# EAGLE design BT840_1.27mm_headers (EAGLE 9.6.2)

## Sheet 1 of 3
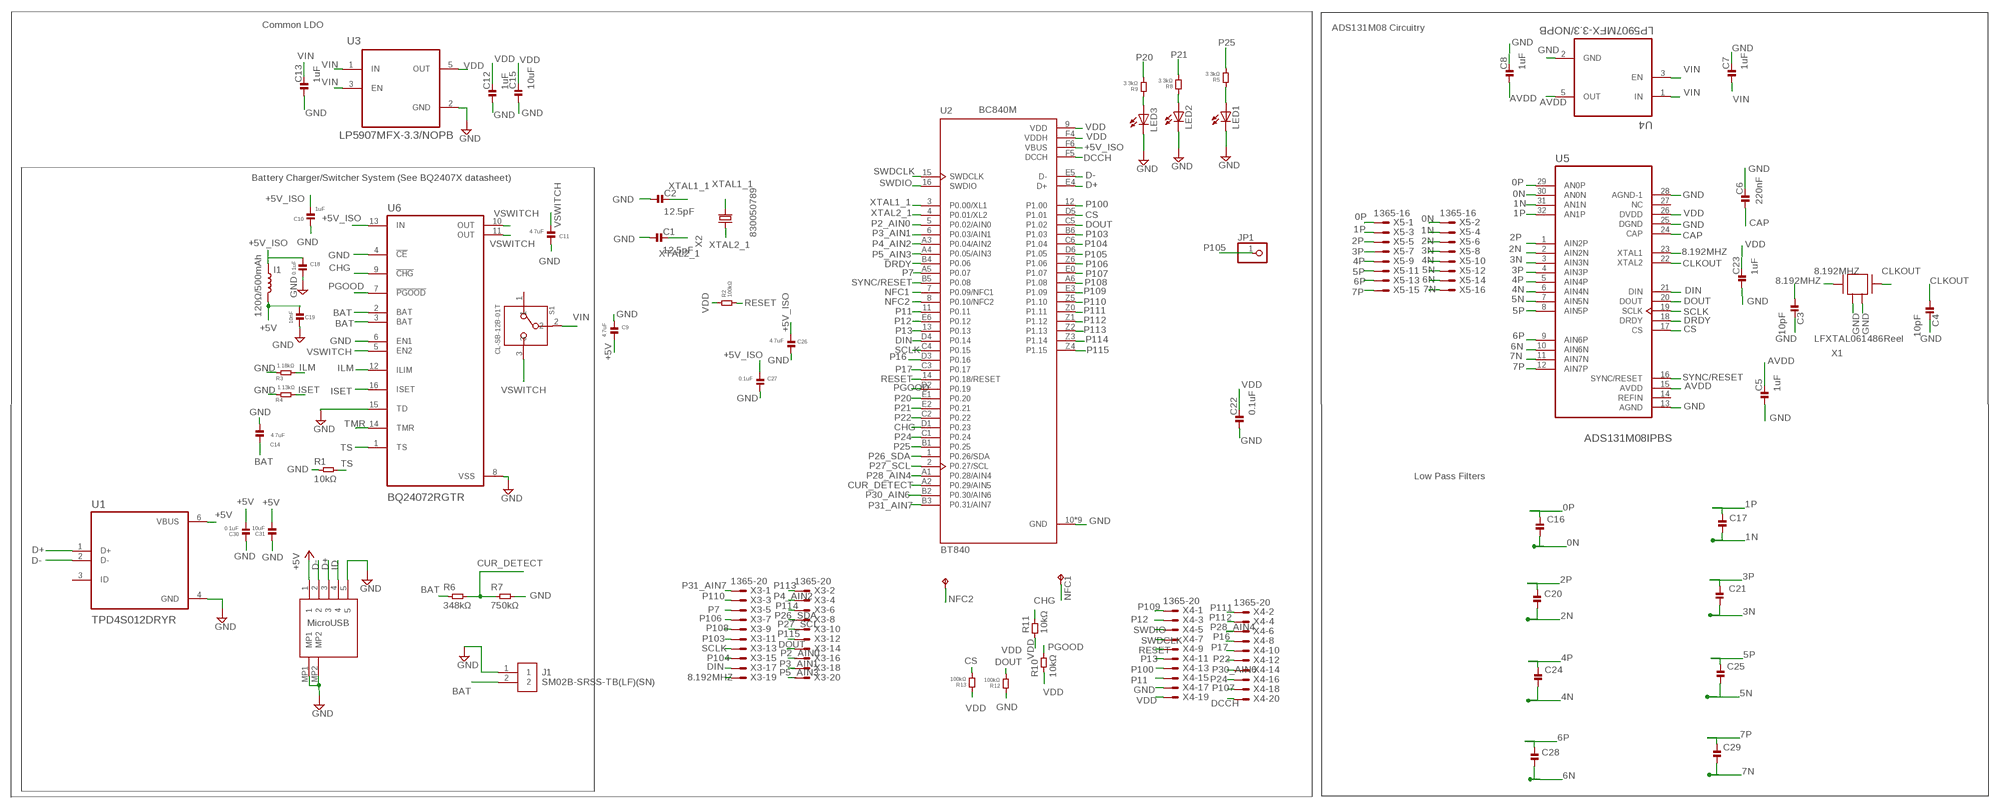
[diagram p0: schematic, sheet 1]

### Parts
C1  12.5pF  CAPACITOR.0201  [0201]
C2  12.5pF  CAPACITOR.0201  [0201]
C3  10pF  CAPACITOR.0201  [0201]
C4  10pF  CAPACITOR.0201  [0201]
C5  1uF  CAPACITOR.0201  [0201]
C6  220nF  CAPACITOR.0201  [0201]
C7  1uF  CAPACITOR.0201  [0201]
C8  1uF  CAPACITOR.0201  [0201]
C9  4.7uF  CAPACITOR.0201  [0201]
C10  1uF  CAPACITOR.0201  [0201]
C11  4.7uF  CAPACITOR.0201  [0201]
C12  1uF  CAPACITOR.0201  [0201]
C13  1uF  CAPACITOR.0201  [0201]
C14  4.7uF  CAPACITOR.0201  [0201]
C15  10uF  CAPACITOR.0402  [0402]
C16  100pF  CAPACITOR.0201  [0201]
C17  100pF  CAPACITOR.0201  [0201]
C18  0.1uF  CAPACITOR.0201  [0201]
C19  10nF  CAPACITOR.0201  [0201]
C20  100pF  CAPACITOR.0201  [0201]
C21  100pF  CAPACITOR.0201  [0201]
C22  0.1uF  CAPACITOR.0201  [0201]
C23  1uF  CAPACITOR.0201  [0201]
C24  100pF  CAPACITOR.0201  [0201]
C25  100pF  CAPACITOR.0201  [0201]
C26  4.7uF  CAPACITOR.0201  [0201]
C27  0.1uF  CAPACITOR.0201  [0201]
C28  100pF  CAPACITOR.0201  [0201]
C29  100pF  CAPACITOR.0201  [0201]
C30  0.1uF  CAPACITOR.0201  [0201]
C31  10uF  CAPACITOR.0402  [0402]
I1  120Ω/500mAh  12NH-0402  [0402_COILCRAFT]
J1  SM02B-SRSS-TB(LF)(SN)  [SM02B-SRSS-TB(LF)(SN)]
JP1  PINHD-1X1  [1X01]
LED1  LEDCHIPLED_0603  [CHIPLED_0603]
LED2  LEDCHIPLED_0603  [CHIPLED_0603]
LED3  LEDCHIPLED_0603  [CHIPLED_0603]
NFC1  TPTP14SQ  [TP14SQ]
NFC2  TPTP14SQ  [TP14SQ]
R1  10kΩ  RESISTOR.0201  [0201]
R2  100kΩ  RESISTOR.0201  [0201]
R3  1.18kΩ  RESISTOR.0201  [0201]
R4  1.13kΩ  RESISTOR.0201  [0201]
R5  3.3kΩ  RESISTOR.0201  [0201]
R6  348kΩ  RESISTOR.0201  [0201]
R7  750kΩ  RESISTOR.0201  [0201]
R8  3.3kΩ  RESISTOR.0201  [0201]
R9  3.3kΩ  RESISTOR.0201  [0201]
R10  10kΩ  RESISTOR.0402  [0402]
R11  10kΩ  RESISTOR.0402  [0402]
R12  100kΩ  RESISTOR.0402  [0402]
R13  100kΩ  RESISTOR.0402  [0402]
S1  CL-SB-12B-01T  [CL-SB-12B]
U1  TPD4S012DRYR  [PSON50P145X100X60-6N]
U2  BT840  [XCVR_BT840]
U3  LP5907MFX-3.3/NOPB  [SOT95P280X145-5N]
U4  LP5907MFX-3.3/NOPB  [SOT95P280X145-5N]
U5  ADS131M08IPBS  [QFP50P700X700X120-32N]
U6  BQ24072RGTR  [QFN50P300X300X100-17N]
U7  DX4R005JJ2R1800  [DX4R005JJ2R1800]
X1  ABM3B-8.000MHZ-B2-T  [ABM3B-8.000MHZ-B2-T]
X2  FC-12M  [FC-12M]
X3  1365-20  [1365-20]
X4  1365-20  [1365-20]
X5  1365-16  [1365-16]

### Nets
0N: C16.2 U5.30(AN0N) X5.2
0P: C16.1 U5.29(AN0P) X5.1
1N: C17.2 U5.31(AN1N) X5.4
1P: C17.1 U5.32(AN1P) X5.3
2N: C20.2 U5.2(AIN2N) X5.6
2P: C20.1 U5.1(AIN2P) X5.5
3N: C21.2 U5.3(AIN3N) X5.8
3P: C21.1 U5.4(AIN3P) X5.7
4N: C24.2 U5.6(AIN4N) X5.10
4P: C24.1 U5.5(AIN4P) X5.9
5N: C25.2 U5.7(AIN5N) X5.12
5P: C25.1 U5.8(AIN5P) X5.11
6N: C28.2 U5.10(AIN6N) X5.14
6P: C28.1 U5.9(AIN6P) X5.13
7N: C29.2 U5.11(AIN7N) X5.16
7P: C29.1 U5.12(AIN7P) X5.15
8.192MHZ: C3.1 U5.23(XTAL1) X1.1 X3.19
+5V: C9.2 C19.2 C30.2 C31.2 I1.P$2 U1.6(VBUS) U7.1
+5V_ISO: C10.2 C18.1 C26.2 C27.2 I1.P$1 U2.F6(VBUS) U6.13(IN)
AVDD: C5.2 C8.1 U4.5(OUT) U5.15(AVDD)
BAT: C14.2 J1.2 R6.1 U6.2(BAT) U6.3(BAT)
CAP: C6.1 U5.24(CAP)
CHG: R11.2 U2.D1(P0.23) U6.9(!CHG)
CLKOUT: C4.1 U5.22(XTAL2) X1.3
CS: R13.1 U2.D5(P1.01) U5.17(CS)
CUR_DETECT: R6.2 R7.1 U2.A2(P0.29/AIN5)
D+: U1.1(D+) U2.E4(D+) U7.3
D-: U1.2(D-) U2.E5(D-) U7.2
DCCH: U2.F5(DCCH) X4.20
DIN: U2.D4(P0.14) U5.21(DIN) X3.17
DOUT: R12.1 U2.C5(P1.02) U5.20(DOUT) X3.14
DRDY: U2.B4(P0.06) U5.18(DRDY)
GND: C1.1 C2.1 C3.2 C4.2 C5.1 C6.2 C7.2 C8.2 C9.1 C10.1 C11.1 C12.1 C13.1 C14.1 C15.1 C18.2 C19.1 C22.1 C23.1 C26.1 C27.1 C30.1 C31.1 J1.1 LED1.C LED2.C LED3.C R1.1 R3.1 R4.1 R7.2 R12.2 U1.4(GND) U2.10(GND) U2.A0(GND) U2.B0(GND) U2.C0(GND) U2.D0(GND) U2.F0(GND) U2.F1(GND) U2.F2(GND) U2.F3(GND) U3.2(GND) U4.2(GND) U5.13(AGND) U5.25(DGND) U5.28(AGND-1) U6.4(!CE) U6.6(EN1) U6.8(VSS) U6.15(TD) U7.5 U7.MP1 U7.MP2 X1.2 X1.4 X4.17
ID: U7.4
ILM: R3.2 U6.12(ILIM)
ISET: R4.2 U6.16(ISET)
LED1: LED1.A R5.2
LED2: LED2.A R8.2
LED3: LED3.A R9.2
NFC1: NFC2.TP U2.7(P0.09/NFC1)
NFC2: NFC1.TP U2.8(P0.10/NFC2)
P2_AIN0: U2.5(P0.02/AIN0) X3.16
P3_AIN1: U2.6(P0.03/AIN1) X3.18
P4_AIN2: U2.A3(P0.04/AIN2) X3.4
P5_AIN3: U2.A4(P0.05/AIN3) X3.20
P7: U2.A5(P0.07) X3.5
P11: U2.11(P0.11) X4.15
P12: U2.E6(P0.12) X4.3
P13: U2.13(P0.13) X4.11
P16: U2.D3(P0.16) X4.8
P17: U2.C3(P0.17) X4.10
P20: R9.1 U2.E1(P0.20)
P21: R8.1 U2.E2(P0.21)
P22: U2.C2(P0.22) X4.12
P24: U2.C1(P0.24) X4.16
P25: R5.1 U2.B1(P0.25)
P26_SDA: U2.1(P0.26/SDA) X3.8
P27_SCL: U2.2(P0.27/SCL) X3.10
P28_AIN4: U2.A1(P0.28/AIN4) X4.6
P30_AIN6: U2.B2(P0.30/AIN6) X4.14
P31_AIN7: U2.B3(P0.31/AIN7) X3.1
P100: U2.12(P1.00) X4.13
P103: U2.B6(P1.03) X3.11
P104: U2.C6(P1.04) X3.15
P105: JP1.1 U2.D6(P1.05)
P106: U2.Z6(P1.06) X3.7
P107: U2.E0(P1.07) X4.18
P108: U2.A6(P1.08) X3.9
P109: U2.E3(P1.09) X4.1
P110: U2.Z5(P1.10) X3.3
P111: U2.Z0(P1.11) X4.2
P112: U2.Z1(P1.12) X4.4
P113: U2.Z2(P1.13) X3.2
P114: U2.Z3(P1.14) X3.6
P115: U2.Z4(P1.15) X3.12
PGOOD: R10.2 U2.D2(P0.19) U6.7(!PGOOD)
RESET: R2.1 U2.14(P0.18/RESET) X4.9
SCLK: U2.C4(P0.15) U5.19(SCLK) X3.13
SWDCLK: U2.15(SWDCLK) X4.7
SWDIO: U2.16(SWDIO) X4.5
SYNC/RESET: U2.B5(P0.08) U5.16(SYNC/RESET)
TMR: U6.14(TMR)
TS: R1.2 U6.1(TS)
VDD: C12.2 C15.2 C22.2 C23.2 R2.2 R10.1 R11.1 R13.2 U2.9(VDD) U2.F4(VDDH) U3.5(OUT) U5.26(DVDD) X4.19
VIN: C7.1 C13.2 S1.2 U3.1(IN) U3.3(EN) U4.1(IN) U4.3(EN)
VSWITCH: C11.2 S1.3 U6.5(EN2) U6.10(OUT) U6.11(OUT)
XTAL1_1: C2.2 U2.3(P0.00/XL1) X2.2
XTAL2_1: C1.2 U2.4(P0.01/XL2) X2.1
Unconnected: S1.1 U1.3(ID) U5.14(REFIN) U5.27(NC)

### Notes on the sheet
- Common LDO
- ADS131M08 Circuitry
- BC840M
- Battery Charger/Switcher System (See BQ2407X datasheet)
- 830050789
- LFXTAL061486Reel
- Low Pass Filters
- MicroUSB

## Sheet 2 of 3

## Sheet 3 of 3

## Library data of the parts
C1-C31 = standardparts:CAPACITOR
I1 = spkfncoils:12NH; MOUSER_PART: 994-0402HP-12NXGLU; PROD_ID: NDUC-15271; VALUE: 12nH
J1 = SM02B-SRSS-TB_LF__SN_:SM02B-SRSS-TB(LF)(SN): JST (JAPAN SOLDERLESS TERMINALS) - SM02B-SRSS-TB (LF)(SN) - HEADER, R/A, 2WAY Source: Datasheet <http://www.jst-mfg.com/product/pdf/eng/eSH.pdf> Check prices <https://pricing.snapeda.com/parts/SM02B-SRSS-TB%28LF%29%28SN%29/JST%20Sales/view-part?ref=eda>; AVAILABILITY: In Stock; DESCRIPTION: Connector Header Surface Mount, Right Angle 2 position 0.039 (1.00mm); MF: JST Sales; MP: SM02B-SRSS-TB(LF)(SN); PACKAGE: None; PRICE: None
JP1 = pinhead:PINHD-1X1: PIN HEADER
LED1-LED3 = adafruit:LED: LED OSRAM: - CHIPLED LG R971, LG N971, LY N971, LG Q971, LY Q971, LO R971, LY R971 LH N974, LH R974 LS Q976, LO Q976, LY Q976 LO Q996 - Hyper CHIPLED LW Q18S LB Q993, LB Q99A, LB R99A - SideLED LS A670, LO A670, LY A670, LG A670, LP A670 LB A673, LV A673, LT A673, LW A673 LH A674 LY A675 LS A676, LA A676, LO A676, LY A676, LW A676 LS A679, LY A679, LG A679 - Hyper Micro SIDELED® LS Y876, LA Y876, LO Y876, LY Y876 LT Y87S - SmartLED LW L88C, LW L88S LB L89C, LB L89S, LG L890 LS L89K, LO L89K, LY L89K LS L896, LA L896, LO L896, LY L896 - TOPLED LS T670, LO T670, LY T670, LG T670, LP T670 LSG T670, LSP T670, LSY T670, LOP T670, LYG T670 LG T671, LOG T671, LSG T671 LB T673, LV T673, LT T673, LW T673 LH T674 LS T676, LA T676, LO T676, LY T676, LB T676, LH T676, LSB T676, LW T676 LB T67C, LV T67C, LT T67C, LS T67K, LO T67K, LY T67K, LW E67C LS E67B, LA E67B, LO E67B, LY E67B, LB E67C, LV E67C, LT E67C LW T67C LS T679, LY T679, LG T679 LS T770, LO T770, LY T770, LG T770, LP T770 LB T773, LV T773, LT T773, LW T773 LH T774 LS E675, LA E675, LY E675, LS T675 LS T776, LA T776, LO T776, LY T776, LB T776 LHGB T686 LT T68C, LB T68C - Hyper Mini TOPLED® LB M676 - Mini TOPLED Santana® LG M470 LS M47K, LO M47K, LY M47K Source: http://www.osram.convergy.de/
NFC1 NFC2 = testpad:TP: Test pad
R1 R2 R4-R13 = standardparts:RESISTOR
R3 = standardparts:RESISTOR; SPICEPREFIX: R
S1 = CL-SB-12B-01T:CL-SB-12B-01T: Check prices <https://pricing.snapeda.com/parts/CL-SB-12B-01T/Nidec%20Copal/view-part?ref=eda>; AVAILABILITY: In Stock; DESCRIPTION: Slide Switch SPDT Surface Mount; MF: Nidec Copal; MP: CL-SB-12B-01T; PACKAGE: None; PRICE: None
U1 = TPD4S012DRYR:TPD4S012DRYR: Check prices <https://pricing.snapeda.com/parts/TPD4S012DRYR/Texas%20Instruments/view-part?ref=eda>; AVAILABILITY: In Stock; DESCRIPTION: 4-channel USB ESD solution with power clamp 6-SON -40 to 85; MF: Texas Instruments; MP: TPD4S012DRYR; PACKAGE: USON-6 Texas Instruments; PRICE: None; PURCHASE-URL: https://pricing.snapeda.com/search/part/TPD4S012DRYR/?ref=eda
U2 = BT840:BT840: Bluetooth LE Module, Nordic nRF52840 SoC, Range 180 meters Check availability <https://pricing.snapeda.com/parts/BT840/Fanstel%20Corp./view-part?ref=eda>; AVAILABILITY: In Stock; DESCRIPTION: 802.15.4, Bluetooth Bluetooth v5.0, Thread, Zigbee® Transceiver Module 2.4GHz Antenna Not Included, U.FL Surface Mount; MF: Fanstel Corp.; MP: BT840; PACKAGE: SMD-16 Fanstel Corp.; PRICE: None; PURCHASE-URL: https://pricing.snapeda.com/search/part/BT840/?ref=eda
U3 U4 = LP5907MFX-3.3_NOPB:LP5907MFX-3.3/NOPB: IC REG LINEAR 3.3V 250MA SOT23; AVAILABILITY: Unavailable; DESCRIPTION: Linear Voltage Regulator IC 1 Output 250mA SOT-23-5; MF: Texas Instruments; MP: LP5907MFX-3.3/NOPB; PACKAGE: SOT-23 Texas Instruments; PRICE: None
U5 = ADS131M08IPBS:ADS131M08IPBS: None Check prices <https://pricing.snapeda.com/parts/ADS131M08IPBS/Texas%20Instruments/view-part?ref=eda>; AVAILABILITY: Warning; DESCRIPTION: 24-bit 32-kSPS 8-channelsimultaneous-sampling delta-sigma ADC 32-TQFP -40 to 125; MF: Texas Instruments; MP: ADS131M08IPBS; PACKAGE: TQFP-32 Texas Instruments; PRICE: None; PURCHASE-URL: https://pricing.snapeda.com/search/part/ADS131M08IPBS/?ref=eda
U6 = BQ24072RGTR:BQ24072RGTR: Check prices <https://pricing.snapeda.com/parts/BQ24072RGTR/Texas%20Instruments/view-part?ref=eda>; AVAILABILITY: In Stock; DESCRIPTION: Standalone 1-cell 1.5-A linear charger, Power Path, 4.2-V VBAT and VOUT=VBAT + 225mV 16-VQFN -40 to 85; MF: Texas Instruments; MP: BQ24072RGTR; PACKAGE: VQFN-16 Texas Instruments; PRICE: None; PURCHASE-URL: https://pricing.snapeda.com/search/part/BQ24072RGTR/?ref=eda
U7 = DX4R005JJ2R1800:DX4R005JJ2R1800: Check prices <https://pricing.snapeda.com/parts/DX4R005JJ2R1800/JAE%20Electronics/view-part?ref=eda>; AVAILABILITY: In Stock; DESCRIPTION: USB - micro B USB 2.0 Receptacle Connector 5 Position Surface Mount, Right Angle; Through Hole; MF: JAE Electronics; MP: DX4R005JJ2R1800; PACKAGE: None; PRICE: None
X1 = Crystals_Oscillators:ABM3B-8.000MHZ-B2-T: CRYSTAL 8.0000MHZ 18PF SMD Manufacturer's datasheet <https://abracon.com/Resonators/abm3b.pdf>; CREATED_BY: PCBLayout.com; DIGIKEY_PART_NUMBER: 535-9720-2-ND; MANUFACTURER: Abracon LLC; MPN: ABM3B-8.000MHZ-B2-T; PACKAGE: SMD 4
X2 = crystal:FC-12M: kHz RANGE CRYSTAL UNIT LOW PROFILE SMD Source: Epson Toyocom FC-12M.pdf
X3 X4 = con-leotronics:1365-20: DUAL ROW STRAIGHT HEADER 1364 SERIES. 1.27mm x 1.27mm. Without Fixing Post. SMT Source: http://www.leotronics.co.uk/Conexcon/Data%20Sheets/sec.%20A/1364ing.pdf; OC_FARNELL: unknown; OC_NEWARK: unknown
X5 = con-leotronics:1365-16: DUAL ROW STRAIGHT HEADER 1364 SERIES. 1.27mm x 1.27mm. Without Fixing Post. SMT Source: http://www.leotronics.co.uk/Conexcon/Data%20Sheets/sec.%20A/1364ing.pdf; OC_FARNELL: unknown; OC_NEWARK: unknown

## Board
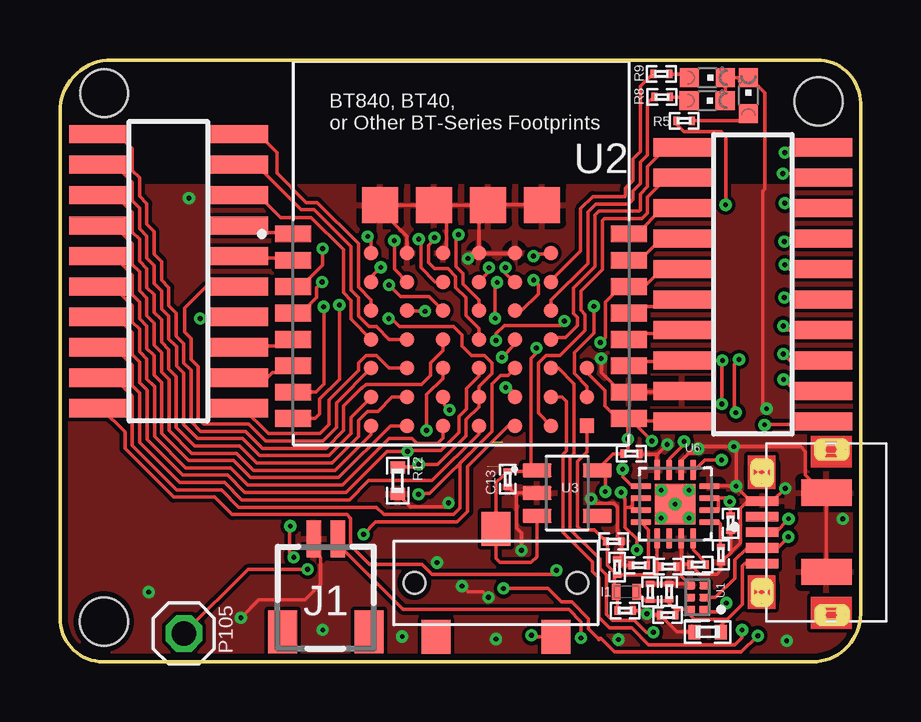
[diagram p1: board, top side]
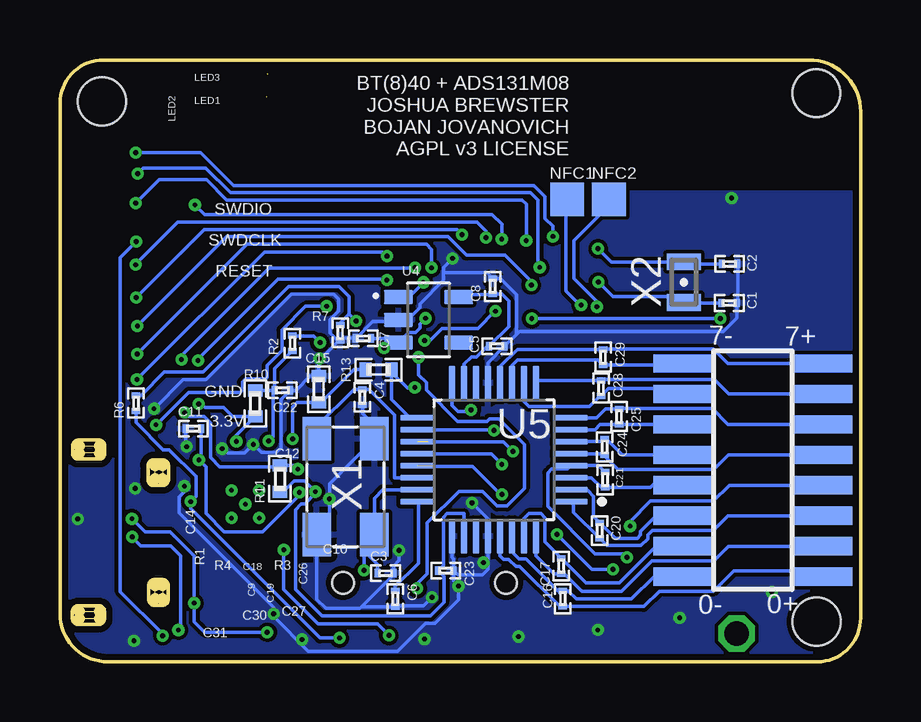
[diagram p2: board, bottom side, seen from below]

Size 33.38 x 25.1 mm. Coordinates in mm from the lower left corner, seen from the top.
Outline: 31.75,1.56 arc-90 31.52,1.79 31.52,2.1 arc-90 31.75,2.34 32.62,2.34 arc-90 32.85,2.1 32.85,1.79 arc-90 32.63,1.56 31.75,1.56
Outline: 31.74,8.45 arc-90 31.51,8.68 31.51,8.98 arc-90 31.74,9.25 32.62,9.25 arc-90 32.84,8.98 32.84,8.68 arc-90 32.62,8.45 31.74,8.45
Outline: 29.67,2.59 arc-90 29.44,2.36 29.1,2.36 arc-90 28.87,2.59 28.87,3.2 arc-90 29.1,3.43 29.44,3.43 arc-90 29.67,3.2 29.67,2.59
Outline: 29.7,7.58 arc-90 29.47,7.35 29.13,7.35 arc-90 28.85,7.58 28.85,8.2 arc-90 29.13,8.42 29.47,8.42 arc-90 29.7,8.19 29.7,7.58
Outline: 33.38,2.01 arc-90 31.37,0 1.8,0 arc-90 0,1.83 0,22.94 arc-90 2.16,25.1 31.55,25.1 arc-90 33.38,23.29 33.38,2.01
Copper layers (1*16): Top 0.035mm / dielectric 1.5mm / Bottom 0.035mm
Design rules "default *": minimum track width 4mil, minimum drill 0.2mm, track to track 6mil, track to pad 6mil, pad to pad 6mil, via to via 6mil, smd to smd 6mil, copper to edge 10mil, drill to drill 6mil, minimum pad ring 6mil, minimum via ring 6mil, stop-mask expansion 4mil, vias tented up to drill 20mil, thermal gap 10mil
Holes 2 mm at 1.84,23.71 31.62,23.36 1.83,1.67

### Footprints (pad centres in the part's own frame; a part is rotated, then mirrored left to right if it is on the bottom)
0201 = smd 0.25 x 0.35: 1 -0.325,0; 2 0.325,0
0402 = smd 0.5 x 0.6: 1 -0.55,0; 2 0.55,0
0402_COILCRAFT = smd 0.356 x 0.66: P$1 -0.432,0; P$2 0.432,0
SM02B-SRSS-TB(LF)(SN) = smd 0.6 x 1.55: 1 -0.5,1.975; 2 0.5,1.975 | smd 1.2 x 1.8: 3 -1.8,-1.9; 4 1.8,-1.9
1X01 = drill 1.016 octagon: 1 0,0
CHIPLED_0603 = smd 0.8 x 0.8: A 0,-0.75; C 0,0.75
TP14SQ = smd 1.4 x 1.4: TP 0,0
CL-SB-12B = smd 1.2 x 1.4: 1 -2.5,-2.25; 2 0,2.25; 3 2.5,-2.25 | hole 0.9: 3.4,0; -3.4,0
PSON50P145X100X60-6N = smd 0.42 x 0.3: 1 -0.29,0.5 | smd 0.41 x 0.3: 2 -0.295,0; 3 -0.295,-0.5; 4 0.295,-0.5; 5 0.295,0; 6 0.295,0.5
XCVR_BT840 = smd 1.5 x 0.7: 1 -7,0.8; 2 -7,-0.3; 3 -7,-1.4; 4 -7,-2.5; 5 -7,-3.6; 6 -7,-4.7; 7 -7,-5.8; 8 -7,-6.9; 9 7,-6.9; 10 7,-5.8; 11 7,-4.7; 12 7,-3.6; 13 7,-2.5; 14 7,-1.4; 15 7,-0.3; 16 7,0.8 | smd 0.6 x 0.6: A0 -2.25,0; A1 -2.25,-1.2; A2 -2.25,-2.4; A3 -2.25,-3.6; A4 -2.25,-4.8; A5 -2.25,-6; A6 -2.25,-7.2; B0 -0.75,0; B1 -0.75,-1.2; B2 -0.75,-2.4; B3 -0.75,-3.6; B4 -0.75,-4.8; B5 -0.75,-6; B6 -0.75,-7.2; C0 0.75,0; C1 0.75,-1.2; C2 0.75,-2.4; C3 0.75,-3.6; C4 0.75,-4.8; C5 0.75,-6; C6 0.75,-7.2; D0 2.25,0; D1 2.25,-1.2; D2 2.25,-2.4; D3 2.25,-3.6; D4 2.25,-4.8; D5 2.25,-6; D6 2.25,-7.2; E0 3.75,0; E1 3.75,-1.2; E2 3.75,-2.4; E3 3.75,-3.6; E4 3.75,-4.8; E5 3.75,-6; E6 3.75,-7.2; F4 5.25,-4.8; F5 5.25,-6; F6 5.25,-7.2; Z0 -3.75,0; Z1 -3.75,-1.2; Z2 -3.75,-2.4; Z3 -3.75,-3.6; Z4 -3.75,-4.8; Z5 -3.75,-6; Z6 -3.75,-7.2 | smd 1.5 x 1.5: F0 -3.375,2; F1 -1.125,2; F2 1.125,2; F3 3.375,2
SOT95P280X145-5N = smd 1.21 x 0.59: 1 -1.255,0.95; 2 -1.255,0; 3 -1.255,-0.95; 4 1.255,-0.95; 5 1.255,0.95
QFP50P700X700X120-32N = smd 1.44 x 0.26: 1 -3.195,1.75; 2 -3.195,1.25; 3 -3.195,0.75; 4 -3.195,0.25; 5 -3.195,-0.25; 6 -3.195,-0.75; 7 -3.195,-1.25; 8 -3.195,-1.75; 17 3.195,-1.75; 18 3.195,-1.25; 19 3.195,-0.75; 20 3.195,-0.25; 21 3.195,0.25; 22 3.195,0.75; 23 3.195,1.25; 24 3.195,1.75 | smd 0.26 x 1.44: 9 -1.75,-3.195; 10 -1.25,-3.195; 11 -0.75,-3.195; 12 -0.25,-3.195; 13 0.25,-3.195; 14 0.75,-3.195; 15 1.25,-3.195; 16 1.75,-3.195; 25 1.75,3.195; 26 1.25,3.195; 27 0.75,3.195; 28 0.25,3.195; 29 -0.25,3.195; 30 -0.75,3.195; 31 -1.25,3.195; 32 -1.75,3.195
QFN50P300X300X100-17N = smd 0.86 x 0.26: 1 -1.435,0.75; 2 -1.435,0.25; 3 -1.435,-0.25; 4 -1.435,-0.75; 9 1.435,-0.75; 10 1.435,-0.25; 11 1.435,0.25; 12 1.435,0.75 | smd 0.26 x 0.86: 5 -0.75,-1.435; 6 -0.25,-1.435; 7 0.25,-1.435; 8 0.75,-1.435; 13 0.75,1.435; 14 0.25,1.435; 15 -0.25,1.435; 16 -0.75,1.435 | smd 1.68 x 1.68: 17 0,0 | drill 0.2 pad 0.4: 18 0,0; 19 -0.58,0.58; 20 0.58,0.58; 21 -0.58,-0.58; 22 0.58,-0.58
DX4R005JJ2R1800 = smd 1.35 x 0.4: 1 1.525,1.3; 2 1.525,0.65; 3 1.525,0; 4 1.525,-0.65; 5 1.525,-1.3 | smd 2.1 x 1.1: MP1 -1.15,1.65; MP2 -1.15,-1.65
ABM3B-8.000MHZ-B2-T = smd 1.8 x 1.2: 1 -2,-1.2; 2 2,-1.2; 3 2,1.2; 4 -2,1.2
FC-12M = smd 0.7 x 1.4: 1 -0.85,0; 2 0.85,0
1365-20 = smd 0.76 x 2.4: 1 -5.715,-2.95; 2 -5.715,2.95; 3 -4.445,-2.95; 4 -4.445,2.95; 5 -3.175,-2.95; 6 -3.175,2.95; 7 -1.905,-2.95; 8 -1.905,2.95; 9 -0.635,-2.95; 10 -0.635,2.95; 11 0.635,-2.95; 12 0.635,2.95; 13 1.905,-2.95; 14 1.905,2.95; 15 3.175,-2.95; 16 3.175,2.95; 17 4.445,-2.95; 18 4.445,2.95; 19 5.715,-2.95; 20 5.715,2.95
1365-16 = smd 0.76 x 2.4: 1 -4.445,-2.95; 2 -4.445,2.95; 3 -3.175,-2.95; 4 -3.175,2.95; 5 -1.905,-2.95; 6 -1.905,2.95; 7 -0.635,-2.95; 8 -0.635,2.95; 9 0.635,-2.95; 10 0.635,2.95; 11 1.905,-2.95; 12 1.905,2.95; 13 3.175,-2.95; 14 3.175,2.95; 15 4.445,-2.95; 16 4.445,2.95

### Placement (x,y rotation side)
C1  5.47,14.96 180 bottom
C2  5.46,16.59 180 bottom
C3  19.8,3.69 0 bottom
C4  20.77,11.04 270 bottom
C5  15.16,13.16 180 bottom
C6  19.4,2.63 270 bottom
C7  20.73,13.48 180 bottom
C8  15.33,15.65 90 bottom
C9  25.4,2.92 270 top
C10  23.09,5.02 180 top
C11  27.81,9.72 0 bottom
C12  23.82,8.68 180 top
C13  18.67,7.61 90 top
C14  27.95,5.78 90 top
C15  22.59,11.37 270 bottom
C16  12.41,2.63 90 bottom
C17  12.48,4 90 bottom
C18  25.37,3.97 0 top
C19  24.61,2.92 270 top
C20  10.87,5.47 90 bottom
C21  10.65,7.59 270 bottom
C22  24.1,11.32 180 bottom
C23  17.29,3.8 180 bottom
C24  10.66,8.96 90 bottom
C25  10.07,10.23 270 bottom
C26  23.23,3.95 270 top
C27  23.56,2.14 180 top
C28  10.82,11.41 270 bottom
C29  10.74,12.7 270 bottom
C30  25.34,1.95 0 top
C31  27.01,1.24 0 top
I1  23.61,2.92 0 top
J1  11.08,3.15 0 top
JP1  5.17,1.18 0 top
LED1  28.7,23.61 0 top
LED2  26.98,23.4 270 top
LED3  26.99,24.36 270 top
NFC1  12.22,19.28 0 bottom
NFC2  10.49,19.28 0 bottom
R1  27.55,4.46 90 top
R2  23.68,13.28 270 bottom
R3  24.15,4.02 0 top
R4  26.6,4.06 0 top
R5  26.02,22.56 0 top
R6  30.2,10.79 90 bottom
R7  21.69,13.72 270 bottom
R8  25.1,23.55 0 top
R9  25.07,24.51 0 top
R10  25.24,10.77 270 bottom
R11  24.2,7.63 90 bottom
R12  14.08,7.55 270 top
R13  20.1,12.18 180 bottom
S1  18.17,3.29 0 top
U1  26.57,2.68 180 top
U2  16.72,17.04 0 top
U3  21.15,7.04 0 top
U4  18.01,14.26 0 bottom
U5  15.28,8.43 180 bottom
U6  25.65,6.57 180 top
U7  30.8,5.4 180 top
X1  21.47,7.3 90 bottom
X2  7.37,15.83 90 bottom
X3  4.53,16.29 270 top
X4  28.89,15.74 270 top
X5  4.49,8 90 bottom

### Tracks (layer width: path | path; a pad name or v marks a point on that pad's centre or on a via)
0N
  Bottom 0.152: X5.2 8.62,3.55 9.55,2.62 11.85,2.62 12.19,2.95 C16.2 12.61,2.95 13.94,4.28 14.24,4.28 14.54,4.58 U5.30
0P
  Bottom 0.152: X5.1 1.78,3.8 5.29,3.8 6.14,2.94 8.4,2.94 9.03,2.3 C16.1 | C16.1 12.45,2.34 | C16.1 12.54,2.3 14.21,3.97 14.36,3.97 14.67,4.28 14.89,4.28 15.03,4.42 U5.29
1N
  Bottom 0.152: X5.4 8.53,4.82 10.05,3.3 11.45,3.3 C17.2 13.15,5 13.15,6.01 13.33,6.18 13.82,6.18 14.03,5.97 U5.31
1P
  Bottom 0.152: U5.32 13.53,4.42 12.78,3.67 C17.1 12.35,3.67 11.61,2.93 9.97,2.93 8.69,4.21 6.12,4.21 5.51,4.82 X5.3
2N
  Bottom 0.152: U5.2 12.05,7.14 11.37,7.14 11.14,6.91 11.14,6.07 C20.2 10.23,5.15 9.31,5.15 9.17,5.3 9.17,5.45 8.52,6.09 X5.6
2P
  Bottom 0.152: X5.5 5.53,6.09 6.14,5.48 8.68,5.48 8.86,5.3 8.86,5.13 9.15,4.85 10.57,4.85 C20.1 11.96,6.24 11.96,6.55 U5.1
3N
  Bottom 0.152: X5.8 7.62,7.54 8.49,7.54 8.77,7.26 C21.2 | 10.61,7.26 C21.2 | U5.3 11.21,7.68 10.79,7.26 C21.2
3P  (via drill 0.2)
  Top 0.152: v9.75,4.36 9.57,4.53 9.57,5.62 v9.6,5.66
  Bottom 0.152: X5.7 5.47,7.36 6.13,6.7 8.77,6.7 9.6,5.86 v9.6,5.66 | C21.1 10.92,8.18 U5.4 12.23,8.04 12.88,8.04 13.04,7.88 13.04,6.47 11.07,4.51 9.9,4.51 v9.75,4.36
4N
  Bottom 0.152: U5.6 10.83,9.19 10.73,9.28 C24.2 10.58,9.28 9.93,8.63 X5.10
4P
  Bottom 0.152: X5.9 5.52,8.63 6.12,8.02 10.11,8.02 10.69,8.61 C24.1 10.71,8.68 U5.5
5N
  Bottom 0.152: U5.7 11.08,9.68 10.86,9.9 C25.2 X5.12
5P
  Bottom 0.152: X5.11 5.52,9.9 6.18,10.56 10.05,10.56 C25.1 10.63,10.55 11,10.18 U5.8
6N
  Bottom 0.152: X5.14 7.66,11.39 10.51,11.39 C28.2 10.87,11.09 11.31,10.65 13.83,10.65 14.03,10.86 U5.10
6P
  Bottom 0.152: X5.13 5.5,11.17 6.1,11.78 10.78,11.78 C28.1 13.42,11.74 U5.9
7N
  Bottom 0.152: U5.11 14.53,12.36 14.3,12.59 10.95,12.59 C29.2 7.5,12.38 X5.16
7P
  Bottom 0.152: U5.12 15.03,12.31 14.31,13.03 C29.1 10.72,13.05 6.13,13.05 5.52,12.44 X5.15
8.192MHZ  (via drill 0.2)
  Top 0.152: v20.7,3.81 20.55,3.66 15.51,3.66 15.1,4.07 12.9,4.07 12.12,4.85 12.12,5.99 11.97,6.14 7.18,6.14 6.45,6.87 4.73,6.87 2.71,8.89 2.71,9.58 1.72,10.57 X3.19 2.12,10.57
  Bottom 0.152: U5.23 19.92,7.17 20.27,6.82 X1.1 | X1.1 20.46,5.11 20.46,4.4 20.13,4.07 C3.1 | X1.1 20.7,4.87 v20.7,3.81
+5V
  Top 0.152: U7.1 28.54,4.1 28.44,4 28.44,2.4 27.82,1.78 | 27.82,1.78 26.44,1.78 26.27,1.95 U1.6 25.66,2.18 | 25.66,2.18 25.75,2.1 25.66,2.02 C30.2 | 25.66,2.18 25.4,2.45 | 25.4,2.45 25.3,2.55 24.66,2.55 | 24.66,2.55 24.41,2.55 I1.P$2 | 25.4,2.45 C9.2 | C19.2 24.66,2.55 | C31.2 27.56,1.51 27.82,1.78
+5V_ISO
  Top 0.152: U6.13 24.89,4.06 | 24.89,4.06 24.89,3.62 C26.2 | U2.F6 21.97,8.75 21.57,8.35 21.57,5.66 21.72,5.51 22.27,5.51 C10.2 22.82,4.96 22.82,4.01 23.21,3.62 C26.2 | C18.1 24.95,4.06 24.89,4.06 | C26.2 23.12,3.51 23.12,2.98 I1.P$1 23.24,2.86 C27.2
AVDD
  Bottom 0.152: U4.5 16.64,15.32 C8.1 14.96,15.33 14.66,15.04 14.66,13.98 C5.2 15.56,13.16 16.01,12.72 16.22,12.72 16.53,12.41 U5.15
BAT  (via drill 0.2)
  Top 0.152: U6.2 27.45,6.32 27.45,6.81 27.43,6.82 | J1.2 11.63,5.12 11.65,5.1 11.65,4.84 14.3,2.19 21.21,2.19 21.72,1.68 v21.72,0.99 | 27.43,6.82 U6.3 | C14.2 27.95,6.65 v27.93,6.68 27.77,6.84 27.41,6.84 27.43,6.82
  Bottom 0.152: v21.72,0.99 22.53,0.99 27.93,6.39 v27.93,6.68 27.71,6.9 27.71,7.73 28.82,8.84 29.06,8.84 30.2,9.98 R6.1
CAP
  Bottom 0.152: U5.24 18.43,6.63 18.43,4.11 19.4,3.14 C6.1
CHG  (via drill 0.2)
  Top 0.152: U6.9 23.85,7.32 23.46,7.71 v23.46,8.03 v23.46,8.04 | 19.07,15.87 18.94,15.87 | v18.58,16.43 18.58,16.19 18.86,15.91 18.9,15.91 18.94,15.87 | v28.31,12.61 28.12,12.41 28.12,10.44 v28.17,10.39 v28.18,10.39 | U2.D1 18.94,15.87
  Bottom 0.152: v23.46,8.04 23.61,8.18 R11.2 24.25,8.13 26.71,8.13 27.1,8.52 27.1,9.96 27.37,10.24 28.02,10.24 v28.18,10.39 | v18.58,16.43 18.59,16.42 24.66,16.42 28.39,12.69 v28.31,12.61
CLKOUT
  Bottom 0.152: X1.3 22.67,9.82 21.12,11.36 C4.1 20.48,11.36 19.43,10.3 19.43,7.68 U5.22
CS  (via drill 0.2)
  Top 0.152: U2.D5 18.97,11.19 18.65,11.51 v18.58,11.44
  Bottom 0.152: U5.17 18.78,10.18 19.55,10.94 R13.1 19.55,12.07 18.89,11.41 18.61,11.41 v18.58,11.44
CUR_DETECT  (via drill 0.2)
  Top 0.152: v21.03,14.21 20.86,14.03 18.53,14.03 18.18,13.68 v18.18,13.4 | 15.01,14.61 v15.21,14.61 v15.21,14.62 14.49,14.62 U2.A2 14.45,14.64
  Bottom 0.152: R7.1 21.69,14.13 21.32,14.51 | R6.2 30,11.11 29.03,12.08 27.4,12.08 23.84,15.64 21.73,15.64 21.32,15.23 21.32,14.51 | 21.32,14.51 21.06,14.25 21.07,14.25 v21.03,14.21 | v18.18,13.4 17.96,13.4 17.45,13.91 15.95,13.91 15.24,14.62 v15.21,14.62
D+  (via drill 0.2)
  Top 0.152: U7.3 29.85,5.4 30.37,5.93 v30.37,5.97 | v27.78,2.45 27.42,2.09 26.95,2.09 U1.1 | U2.E4 20.78,12.24 21.43,11.59 21.43,8.66 21.26,8.5 21.26,5.53 22.51,4.28 22.51,3.89 22.77,3.63 22.77,1.98 23.02,1.73 23.96,1.73 24.44,1.24 v24.73,1.24 v24.73,1.23
  Bottom 0.152: v30.37,5.97 29.82,5.41 28.77,5.41 27.78,4.42 v27.78,2.45 27.78,1.67 27.34,1.23 v24.73,1.23
D-  (via drill 0.2)
  Top 0.152: U1.2 27.33,2.68 28.13,3.49 28.13,4.25 28.63,4.74 28.69,4.74 28.7,4.75 U7.2 29.92,4.75 v30.37,5.2 30.02,4.86 29.25,4.86 | U2.E5 20.92,11.04 21.11,10.85 21.11,8.8 20.96,8.64 20.96,5.55 20.96,5.41 22.21,4.16 22.21,3.76 22.47,3.5 22.47,1.85 22.91,1.41 23.84,1.41 24.54,0.71 28.14,0.71 28.44,1.01 v28.44,1.33
  Bottom 0.152: v28.44,1.33 28.35,1.41 28.35,4.42 28.77,4.84 30.01,4.84 v30.37,5.2
DCCH  (via drill 0.2)
  Top 0.152: U2.F5 21.97,11.49 21.44,12.02 21.44,12.9 22.25,13.71 v22.25,14.83 v22.26,14.83 | v29.37,9.88 v29.38,9.89 31.7,9.89 X4.20
  Bottom 0.152: v29.37,9.88 29.36,9.88 28.01,11.24 25.87,11.24 25.77,11.34 25.77,11.67 25.63,11.8 24.79,11.8 24.73,11.87 24.73,12.36 24.12,12.97 24.12,13.84 23.13,14.83 v22.26,14.83
DIN  (via drill 0.2)  (1 unrouted)
  Top 0.152: U2.D4 18.67,11.94 18.36,11.94 18,11.59 18,9.6 17.51,9.11 | 17.51,9.11 16.68,8.28 16.68,6.42 16.41,6.14 13.51,6.14 13.2,6.45 7.46,6.45 6.73,7.17 4.86,7.17 3.02,9.02 3.02,9.25 3.01,9.26 3.01,11.08 2.25,11.84 X3.17 | 17.51,9.11 15.41,7.01 14.98,7.01 v14.95,6.98
  Bottom 0.152: v14.95,6.98 15,6.98 16.18,8.16 17.82,8.16
DOUT  (via drill 0.2)
  Top 0.152: v13.7,14.31 13.81,14.31 14.15,13.98 16.41,13.98 16.76,13.63 16.76,13.18 17.16,12.77 17.69,12.77 18.01,12.45 18.01,12.03 17.47,11.49 U2.C5 17.47,10.63 16.94,10.1 16.94,9.41 15.74,8.22 14.97,8.22 v14.96,8.23 14.85,8.12 14.1,8.12 R12.1 | v5.85,14.32 5.86,14.3 6.37,14.3 6.45,14.38 X3.14
  Bottom 0.152: v14.96,8.23 15.39,8.67 U5.20 | v13.7,14.31 | v13.7,14.31 5.88,14.31 5.87,14.32 v5.85,14.32
DRDY  (via drill 0.2)
  Top 0.152: v15.28,9.65 15.29,9.66 15.29,11.14 15.97,11.82 U2.B4
  Bottom 0.152: U5.18 15.3,9.67 v15.28,9.65
GND  (via drill 0.2)
  Top 0.152: U6.15 25.9,4.06 | 25.9,4.06 25.9,3.56 U1.4 26.21,3.25 C9.1 C19.1 | U6.4 v28.19,7.32 | U7.5 28.78,6.7 28.19,7.29 v28.19,7.32 | v28.19,7.32 28.19,8.82 28.04,8.97 | 28.02,8.99 28.04,8.97 | U7.MP1 U7.MP2 31.83,7.05 31.08,7.8 31.08,8.01 31.07,8.01 31.07,8.77 30.87,8.97 28.04,8.97 | v22.56,12.65 22.57,12.63 22.57,12.07 23.39,11.24 U2.10 24.86,11.25 24.91,11.29 X4.17 | 19.44,7.04 U3.2 18.92,7.04 C13.1 | U6.8 24.89,8.64 v25.32,9.06 24.9,8.65 24.18,8.65 C12.1 | v22.15,6.79 22.33,6.61 23.09,6.61 23.24,6.46 23.24,5.12 23.34,5.02 C10.1 23.41,4.09 C26.1 23.48,4.02 R3.1 | 25.9,4.06 R4.1 26.67,3.65 27.38,3.65 27.55,3.83 27.55,4.07 | 25.9,4.06 25.78,4.06 C18.2 | 27.55,4.07 27.65,4.16 27.65,4.24 27.96,4.55 27.96,4.56 | 27.96,4.56 28.36,4.96 28.36,6.39 28.66,6.69 U7.5 | C27.1 24.33,2.14 v24.47,2 24.49,2 24.54,1.95 C30.1 25.72,1.24 C31.1 | 27.96,4.56 27.96,5.44 C14.1 | R1.1 27.55,4.07 | U6.6 25.91,8.02 25.91,8.4 26.22,8.71 26.44,8.71 v26.62,8.89 26.62,8.98 26.62,8.99 28.02,8.99 | 28.02,8.99 28.07,8.99 v28.09,8.97 | U2.A0 14.48,17.74 13.34,18.87 U2.F0 15.51,19.04 15.54,19.01 15.55,19 U2.F1 | U2.B0 16.11,17.19 16.11,18.52 U2.F1 | U2.F1 U2.F2 | 17.47,17.08 U2.C0 17.47,18.67 U2.F2 | U2.F3 20.08,19.06 U2.F2 | U2.F2 17.25,19.06 | U2.F2 | U2.D0 18.94,17.01 17.12,17.01 17.01,16.91 v17.01,16.82 | C13.1 | C13.1 19.02,6.93 19.02,5.59 19.24,5.38 v19.24,4.65 | v17.87,2.69 17.64,2.92 17,2.92 v16.76,3.16 | R12.2 14.61,6.47 16.05,6.47 v16.2,6.62 v16.2,6.63 | U7.5 29.7,6.7 v30.23,7.23 | J1.1 10.58,4.61 10.87,4.32 10.87,3.23 10.21,2.58 8.28,2.58 v7.54,1.83 | LED2.C 27.74,23.42 LED3.C LED1.C 28.77,24.36 29.39,23.74 29.39,19.71 29.3,19.62 29.3,10.7 v29.46,10.55
  Bottom 0.152: C4.2 20.77,10.36 20.21,9.8 20.21,9.36 X1.2 | C5.1 15.53,12.46 U5.13 | 17.39,16.22 15.57,16.22 C8.2 15.02,15.98 14.35,15.3 14.35,13.65 C5.1 | v28.19,7.32 28.19,7.1 28.41,6.88 28.41,6.2 24.47,2.27 v24.47,2 24.47,1.9 23.02,0.45 19.3,0.45 18.14,1.6 17.75,1.6 16.76,2.59 v16.76,3.16 16.97,3.37 C23.1 | 20.8,2.3 20.88,2.22 22.28,2.22 22.67,2.61 X1.4 22.15,5.82 v22.15,6.79 22.15,7.42 X1.2 | 20.8,2.3 19.48,3.62 C3.2 19.48,3.98 19.24,4.22 v19.24,4.65 | C5.1 14.83,13.15 | v25.32,9.06 25.32,9.03 | C11.1 28.14,9.02 v28.09,8.97 | v25.32,9.06 25.67,8.71 26.39,8.71 26.57,8.89 v26.62,8.89 | C2.1 5.11,16.57 5.11,15 C1.1 5.15,14.33 5.71,13.77 14.23,13.77 C5.1 | U5.25 17.04,5.22 17.04,4.36 16.97,4.29 C23.1 | v25.32,9.06 24.97,8.72 24.37,8.72 24.16,8.93 24.16,10.93 C22.1 23.54,11.32 22.94,11.92 C15.1 22.6,11.93 22.6,12.57 22.55,12.63 v22.56,12.65 22.49,12.65 21.74,13.39 R7.2 | R7.2 21.59,13.5 21.06,13.5 C7.2 20.34,14.18 19.34,14.18 U4.2 18.89,14.26 18.37,14.78 18.37,14.93 17.39,15.92 17.39,16.22 | X1.2 20.34,9.3 | 15.54,4.23 15.54,5.05 15.53,5.05 U5.28 15.53,5.97 v16.2,6.63 | 15.54,4.23 15.54,3.86 15.77,3.63 16.79,3.63 C23.1 | 20.8,2.3 C6.2 19.36,2.34 18.22,2.34 v17.87,2.69 | v17.01,16.82 17.39,16.45 17.39,16.22 | R7.2 21.81,13.39 22.12,13.71 22.12,14.27 21.77,14.62 21.77,15.13 21.97,15.33 23.71,15.33 27.28,11.77 28.23,11.77 v29.46,10.55 | 15.54,4.23 15.63,4.23 v15.72,4.14
  other vias: 3.7,2.91 5.38,19.34 14.27,1.05 30.29,0.87 32.63,5.95 23.28,0.93 18.18,0.95 10.96,1.33
  pour Top: 0.55,-0.98 -0.72,0.29 -0.72,19.34 -0.21,19.85 34.33,19.85 34.84,19.34 34.84,1.56 32.3,-0.98
  pour Bottom: 0.55,-1.23 -0.97,0.29 -0.97,19.09 -0.97,19.34 -0.72,19.59 34.08,19.59 34.59,19.09 34.59,1.56 31.79,-1.23
ILM
  Top 0.152: U6.12 24.53,5.51 24.53,4.07 R3.2
ISET
  Top 0.152: U6.16 26.4,4.66 26.92,4.14 R4.2
LED1
  Top 0.152: R5.2 28.4,22.56 LED1.A
LED2
  Top 0.152: R8.2 26.08,23.55 LED2.A
LED3
  Top 0.152: R9.2 26.08,24.51 LED3.A
NFC1  (via drill 0.2)
  Top 0.152: U2.7 10.67,11.24 11.02,11.59 11.02,14.78 v10.99,14.8
  Bottom 0.152: v10.99,14.8 | v10.99,14.8 10.99,15.03 11.95,15.99 11.95,17.56 10.49,19.03 NFC2.TP
NFC2  (via drill 0.2)
  Top 0.152: U2.8 10.63,10.14 10.81,10.33 10.81,10.95 11.65,11.78 v11.65,14.87
  Bottom 0.152: v11.65,14.87 11.7,14.87 12.28,15.45 12.28,19.23 NFC1.TP
P2_AIN0
  Top 0.152: U2.5 9.44,13.16 8.68,13.16 8.63,13.11 X3.16
P3_AIN1
  Top 0.152: U2.6 9.45,12.07 8.87,12.07 8.65,11.85 8.64,11.84 X3.18
P4_AIN2
  Top 0.152: U2.A3 13.72,13.44 13.19,13.97 12.89,13.97 12.44,14.43 12.44,15.19 12.14,15.5 12.14,17.31 10.59,18.85 10.05,18.85 8.17,20.73 X3.4
P5_AIN3
  Top 0.152: U2.A4 13.72,12.24 13.19,12.77 12.75,12.77 12.44,12.46 12.44,12.15 11.22,10.93 11.22,9.9 10.84,9.52 8.7,9.52 7.64,10.57 X3.20
P7
  Top 0.152: U2.A5 13.85,11.04 13.25,10.45 12.82,10.45 12.44,10.06 12.44,9.39 11.34,8.29 8.2,8.29 7.49,9 5.62,9 4.85,9.77 4.85,11.9 4.54,12.22 4.54,13.03 4.23,13.33 4.23,14.27 3.93,14.57 3.93,15.31 3.62,15.62 3.62,16.4 3.32,16.71 3.32,17.62 3.01,17.92 3.01,18.74 2.29,19.46 X3.5
P11
  Top 0.152: U2.11 23.9,12.53 25.9,12.53 X4.15
P12
  Top 0.152: U2.E6 19.94,10.37 19.94,12.46 20.25,12.77 20.85,12.77 21.89,13.81 21.89,14.49 21.72,14.66 21.72,15.46 22.61,16.35 22.61,18.39 22.7,18.48 23.9,18.48 | 23.9,18.48 | 23.9,18.48 23.9,18.49 24.26,18.49 24.49,18.72 24.49,19.37 25.3,20.18 X4.3
P13
  Top 0.152: U2.13 23.99,14.81 25.64,14.81 X4.11
P16  (via drill 0.2)
  Top 0.152: U2.D3 18.97,13.24 v18.42,12.7 | v18.49,3.06 20.34,3.06 20.91,2.5 21.33,2.5 22.03,1.8 22.03,1.37 22.42,0.98 | 22.42,0.98 22.48,0.93 | 22.42,0.98 22.55,0.98 23.12,0.41 28.41,0.41 v29.09,1.09 | v30.19,17.53 30.31,17.64 X4.8
  Bottom 0.152: v18.42,12.7 18.42,11.96 18.1,11.64 18.1,11.33 16.8,10.03 15.58,10.03 15.48,10.13 15.08,10.13 14.01,9.06 14.01,7.23 14.75,6.5 15.15,6.5 15.76,7.11 16.74,7.11 18.07,5.78 18.07,3.66 18.49,3.24 v18.49,3.06 | v29.09,1.09 29.09,1.16 30.86,2.92 30.86,16.87 v30.19,17.53
P17  (via drill 0.2)
  Top 0.152: U2.C3 17.47,13.89 16.93,14.43 16.93,15.18 16.5,15.62 16.5,16.06 16.17,16.39 15.61,16.39 15.36,16.64 15.36,17.35 15.62,17.6 v15.62,17.69 | v30.22,16.56 30.4,16.37 X4.10
  Bottom 0.152: v15.62,17.69 15.62,17.97 15.98,18.34 28.47,18.34 30.25,16.56 v30.22,16.56
P20  (1 unrouted)
  Top 0.152: U2.E1 20.47,15.9 21.7,17.13 21.7,18.89 22.21,19.4 23.55,19.4 23.58,19.43 23.58,19.76 23.88,20.06 23.88,20.97 24.19,21.27 24.19,23.99 24.7,24.5
P21  (1 unrouted)
  Top 0.152: U2.E2 20.47,15.08 22,16.61 22,18.75 22.34,19.1 23.71,19.1 23.88,19.27 23.88,19.63 24.19,19.93 24.19,20.83 24.49,21.14 24.49,23.31 24.75,23.57
P22  (via drill 0.2)
  Top 0.152: U2.C2 17.47,15.07 16.8,15.74 16.8,16.19 16.5,16.49 16.5,17.71 v16.61,17.81 | v30.2,15.19 30.29,15.1 X4.12
  Bottom 0.152: v16.61,17.81 16.83,18.03 27.36,18.03 v30.2,15.19
P24  (via drill 0.2)
  Top 0.152: v17.89,16.43 17.89,16.26 U2.C1 | v30.16,12.84 30.43,12.56 X4.16
  Bottom 0.152: v17.89,16.43 17.89,17.2 18.1,17.41 25.58,17.41 v30.16,12.84
P25  (via drill 0.2)
  Top 0.152: v14.96,17.63 15.04,17.54 15.04,16.44 15.64,15.84 U2.B1 | v14.96,17.63 | v27.75,19.05 27.75,21.93 27.58,22.1 26.02,22.1 25.69,22.42 R5.1
  Bottom 0.152: v14.96,17.63 14.96,18.24 15.36,18.64 27.34,18.64 v27.75,19.05
P26_SDA
  Top 0.152: U2.1 9.67,17.9 8.6,17.9 8.3,18.19 X3.8
P27_SCL
  Top 0.152: U2.2 9.63,16.83 8.61,16.83 8.53,16.92 X3.10
P28_AIN4  (via drill 0.2)
  Top 0.152: U2.A1 13.94,16.38 v13.94,17.56 | v30.22,19.12 31.63,19.12 X4.6
  Bottom 0.152: v13.94,17.56 13.94,19.07 14.11,19.25 26.42,19.25 27.27,20.1 29.25,20.1 v30.23,19.12 v30.22,19.12
P30_AIN6  (via drill 0.2)
  Top 0.152: v30.15,14.01 30.32,13.83 X4.14 | U2.B2 15.38,15.23 14.2,15.23 v13.72,15.71
  Bottom 0.152: v30.15,14.01 26.44,17.72 17.2,17.72 16.43,16.95 14.83,16.95 13.72,15.85 v13.72,15.71
P31_AIN7
  Top 0.152: U2.B3 15.97,12.99 15.44,12.46 15.44,11.93 15.08,11.57 12.75,11.57 12.6,11.42 12.58,11.42 11.83,10.67 11.83,9.65 11.09,8.9 8.45,8.9 7.74,9.61 5.87,9.61 5.46,10.02 5.46,12.17 5.17,12.47 5.17,13.27 4.84,13.59 4.84,14.55 4.54,14.85 4.54,15.61 4.23,15.91 4.23,16.7 3.93,17 3.93,17.94 3.62,18.25 3.62,19.11 3.32,19.41 3.32,20.18 3.01,20.49 3.01,21.4 2.41,22 X3.1
P100
  Top 0.152: U2.12 24.14,13.44 24.38,13.68 25.79,13.68 X4.13
P103
  Top 0.152: U2.B6 15.96,9.34 15.74,9.11 14.88,9.11 14.68,9.31 13.71,9.31 11.78,7.37 7.82,7.37 7.11,8.09 5.24,8.09 3.94,9.39 3.94,11.47 3.62,11.79 3.62,12.63 3.32,12.94 3.32,13.87 3.01,14.17 3.01,14.86 2.22,15.65 X3.11
P104
  Top 0.152: U2.C6 17.47,9.51 15.52,7.56 12.87,7.56 12.07,6.75 7.58,6.75 6.86,7.48 4.99,7.48 3.32,9.14 3.32,11.21 3.01,11.52 3.01,12.37 2.27,13.11 X3.15
P105  (via drill 0.2)
  Top 0.152: 18.91,9.84 U2.D6 18.68,9.84 16.99,8.15 16.99,6.27 16.55,5.83 13.16,5.83 v12.66,5.32 | v10.32,3.86 v10.32,3.85 7.84,3.85 JP1.1
  Bottom 0.152: v12.66,5.32 11.19,3.86 v10.32,3.86
P106
  Top 0.152: U2.Z6 12.97,9.49 11.47,7.99 8.07,7.99 7.36,8.7 5.49,8.7 4.55,9.64 4.55,11.77 4.23,12.08 4.23,12.9 3.93,13.2 3.93,14.13 3.62,14.44 3.62,15.17 3.32,15.47 3.32,16.27 3.01,16.57 3.01,17.44 2.26,18.19 X3.7
P107  (via drill 0.2)
  Top 0.152: U2.E0 20.47,17 19.83,17 v19.74,16.91 | v30.17,11.78 30.65,11.29 X4.18
  Bottom 0.152: v30.17,11.78 24.85,17.09 19.92,17.09 v19.74,16.91
P108
  Top 0.152: U2.A6 13.78,9.84 11.62,7.68 7.95,7.68 7.24,8.39 5.36,8.39 4.24,9.51 4.24,11.64 3.93,11.96 3.93,12.77 3.62,13.07 3.62,14.01 3.32,14.31 3.32,15 3.01,15.31 3.01,16.13 2.83,16.31 2.22,16.92 X3.9
P109
  Top 0.152: U2.E3 20.56,13.53 21.07,13.53 21.57,14.03 21.57,14.36 21.4,14.52 21.4,15.58 22.31,16.48 22.31,18.63 22.47,18.79 24.14,18.79 24.19,18.84 24.19,19.5 24.49,19.81 24.49,20.65 25.3,21.46 X4.1
P110  (1 unrouted)
  Top 0.152: 12.87,11.04 U2.Z5 12.97,11.02 12.14,10.19 12.14,9.52 11.22,8.6 8.65,8.6 8.32,8.6 7.61,9.31 5.74,9.31 5.16,9.89 5.16,12.04 4.86,12.33 4.86,13.14 4.54,13.46 4.54,14.41 4.23,14.72 4.23,15.46 3.93,15.76 3.93,16.53 3.62,16.84 3.62,17.75 3.32,18.06 3.32,18.92 3.01,19.23 3.01,20.01 2.29,20.73 X3.3
P111  (via drill 0.2)
  Top 0.152: U2.Z0 12.97,17.6 v12.83,17.74 | v30.22,21.23 30.44,21.45 X4.2
  Bottom 0.152: v12.83,17.74 12.83,18.17 13.15,18.49 13.15,19.4 13.61,19.86 26.14,19.86 27.51,21.23 v30.22,21.23 30.23,21.23
P112  (via drill 0.2)
  Top 0.152: U2.Z1 12.97,16.03 v13.37,16.44 v13.37,16.45 | v30.14,20.36 31.66,20.36 X4.4
  Bottom 0.152: v13.37,16.45 13.46,16.53 13.46,19.26 13.76,19.56 26.26,19.56 27.3,20.59 29.91,20.59 v30.14,20.36
P113
  Top 0.152: U2.Z2 12.97,15.09 12.44,15.62 12.44,17.44 10.72,19.16 10.27,19.16 9.06,20.37 9.06,21.23 8.28,22 X3.2
P114
  Top 0.152: U2.Z3 12.13,14.28 12.13,15.07 11.81,15.39 11.81,17.18 10.46,18.53 9.19,18.53 8.25,19.46 X3.6
P115
  Top 0.152: U2.Z4 11.53,10.8 11.53,9.77 10.97,9.21 8.57,9.21 7.87,9.92 6,9.92 5.77,10.15 5.77,12.31 5.47,12.61 5.47,13.48 5.19,13.75 5.19,14.74 6.1,15.65 X3.12
PGOOD  (via drill 0.2)
  Top 0.152: U6.7 25.4,8.46 26.02,9.08 v26.02,9.19 | v19.75,15.92 19.94,15.73 19.94,15.33 19.25,14.64 U2.D2 | v27.6,10.76 27.6,12.54 v27.62,12.56
  Bottom 0.152: v26.02,9.19 26.02,9.44 R10.2 26.18,10.22 26.56,10.61 27.32,10.61 27.47,10.76 v27.6,10.76 | v19.75,15.92 19.78,15.96 24.28,15.96 27.62,12.62 v27.62,12.56
RESET  (via drill 0.2)
  Top 0.152: v22.53,13.31 22.74,13.52 22.74,15 23.39,15.64 U2.14 24.36,15.64 25.1,16.37 X4.9
  Bottom 0.152: R2.1 23.65,13.58 22.8,13.58 v22.53,13.31
SCLK  (via drill 0.2)  (1 unrouted)
  Top 0.152: X3.13 2.36,14.38 3.01,13.74 3.01,12.81 3.32,12.5 3.32,11.65 3.63,11.34 3.63,9.27 5.11,7.78 6.98,7.78 7.7,7.06 11.92,7.06 13.64,8.78 v14.49,8.78 14.49,8.81 15.88,8.81 16.63,9.56 16.63,10.22 16.94,10.53 16.94,11.39 17.47,11.92 U2.C4
  Bottom 0.152: v14.49,8.78 14.88,9.16 18.03,9.16
SWDCLK
  Top 0.152: U2.15 24.17,16.74 25.07,17.64 X4.7
SWDIO
  Top 0.152: U2.16 24.05,17.84 25.12,18.91 X4.5
SYNC/RESET  (via drill 0.2)
  Top 0.152: U2.B5 16.03,11.04 16.03,10.71 v16.23,10.51
  Bottom 0.152: U5.16 17.02,11.61 17.02,10.68 16.77,10.43 16.31,10.43 v16.23,10.51 | v16.23,10.51
TS
  Top 0.152: R1.2 27.54,4.8 27.54,5.75 27.47,5.82 U6.1
VDD  (via drill 0.2)
  Top 0.152: 23.68,8.86 C12.2 | U2.9 23.68,10.1 23.68,8.86 | U2.F4 21.97,12.06 22.72,11.31 22.72,10.67 23.25,10.14 U2.9 | 23.68,9.21 v23.68,9.3 23.68,8.86 | v24.67,9.21 23.73,10.14 U2.9 | v22.73,7.09 22.73,7.67 U3.5 22.4,8.02 23.06,8.67 C12.2 | U2.9 23.82,10.04 25,10.04 25.02,10.02 X4.19 | 23.68,8.86 C12.2
  Bottom 0.152: U5.26 16.53,6.18 17.24,6.18 17.39,6.03 17.39,5.94 17.39,4.03 C23.2 17.37,3.56 17.37,2.47 17.93,1.92 22.45,1.92 23.56,3.03 23.56,6.34 23.32,6.58 23.17,6.58 22.73,7.01 v22.73,7.09 | v22.73,7.09 22.73,6.98 | R13.2 21.11,12.19 22.35,10.96 22.45,10.96 C15.2 23.5,10.82 23.68,10.64 v23.68,9.3 | R2.2 23.71,12.96 24.43,12.24 C22.2 | C22.2 24.5,11.25 24.5,9.38 v24.67,9.21 | R11.1 24.08,7.08 23.61,7.55 23.18,7.55 v22.73,7.1 v22.73,7.09 | R10.1 24.41,11.32 C22.2
VIN  (via drill 0.2)
  Top 0.152: S1.2 18.48,5.24 | S1.2 18.17,7.48 C13.2 19.85,7.94 U3.1 | 20.36,6.09 U3.3 19.88,6.07 19.88,4.38 19.65,4.15 18.35,4.15 18.17,4.32 S1.2 | 20.23,7.99 U3.1 | v19.86,13.08 19.86,12.89 19.63,12.66 19.63,8.25 U3.1 | v18.23,15.82 18.14,15.74 v18.14,14.33
  Bottom 0.152: v19.86,13.08 19.49,13.08 U4.3 | U4.1 19.32,15.16 18.9,15.16 v18.23,15.82 | U4.3 18.84,13.73 18.56,13.73 18.37,13.92 18.37,14.09 v18.14,14.33 | C7.1 19.45,13.49 U4.3
VSWITCH  (via drill 0.2)
  Top 0.152: 23.86,6.54 23.86,6.82 U6.10 | 23.86,6.54 23.86,6.32 U6.11 | v24.04,4.66 24.04,5.12 23.55,5.61 23.55,6.44 | S1.3 19.72,1.04 v19.66,1.1 | U6.5 26.47,8.01 26.88,8.42 v27.58,8.42 | v23.4,7.06 23.4,6.94 23.55,6.78 23.55,6.44 | 23.86,6.54 23.75,6.44 23.55,6.44
  Bottom 0.152: v24.04,4.66 24.04,3.02 22.61,1.59 20.15,1.59 v19.66,1.1 | v23.4,7.06 23.4,6.95 24.92,5.42 26.52,5.42 27.29,6.18 27.29,8.12 v27.58,8.42 27.49,8.52 C11.2
XTAL1_1  (via drill 0.2)
  Top 0.152: v10.94,17.23 10.94,16.53 10.05,15.64 U2.3
  Bottom 0.152: v10.94,17.23 10.39,16.68 X2.2 7.28,16.59 C2.2
XTAL2_1  (via drill 0.2)
  Top 0.152: v10.93,15.84 10.7,15.6 10.7,15.19 10.05,14.54 U2.4
  Bottom 0.152: v10.93,15.84 10.33,15.23 7.62,15.23 X2.1 7.35,14.96 C1.2

### Text on the board
tPlace: BT840, BT40, / or Other BT-Series Footprints | I1
bPlace: BT(8)40 + ADS131M08 / JOSHUA BREWSTER / BOJAN JOVANOVICH / AGPL v3 LICENSE
tNames: P105
bNames: SWDIO | SWDCLK | RESET | 7+ | 7- | GND | 3.3V | 0+ | 0-
tValues: G | V
Document: RESET | SWDIO | SWO | SWDCLK | GND | VDD